# Altium schematic sheet Sheet3.SchDoc
size A3; SheetNumber: 1; SheetTotal: 2
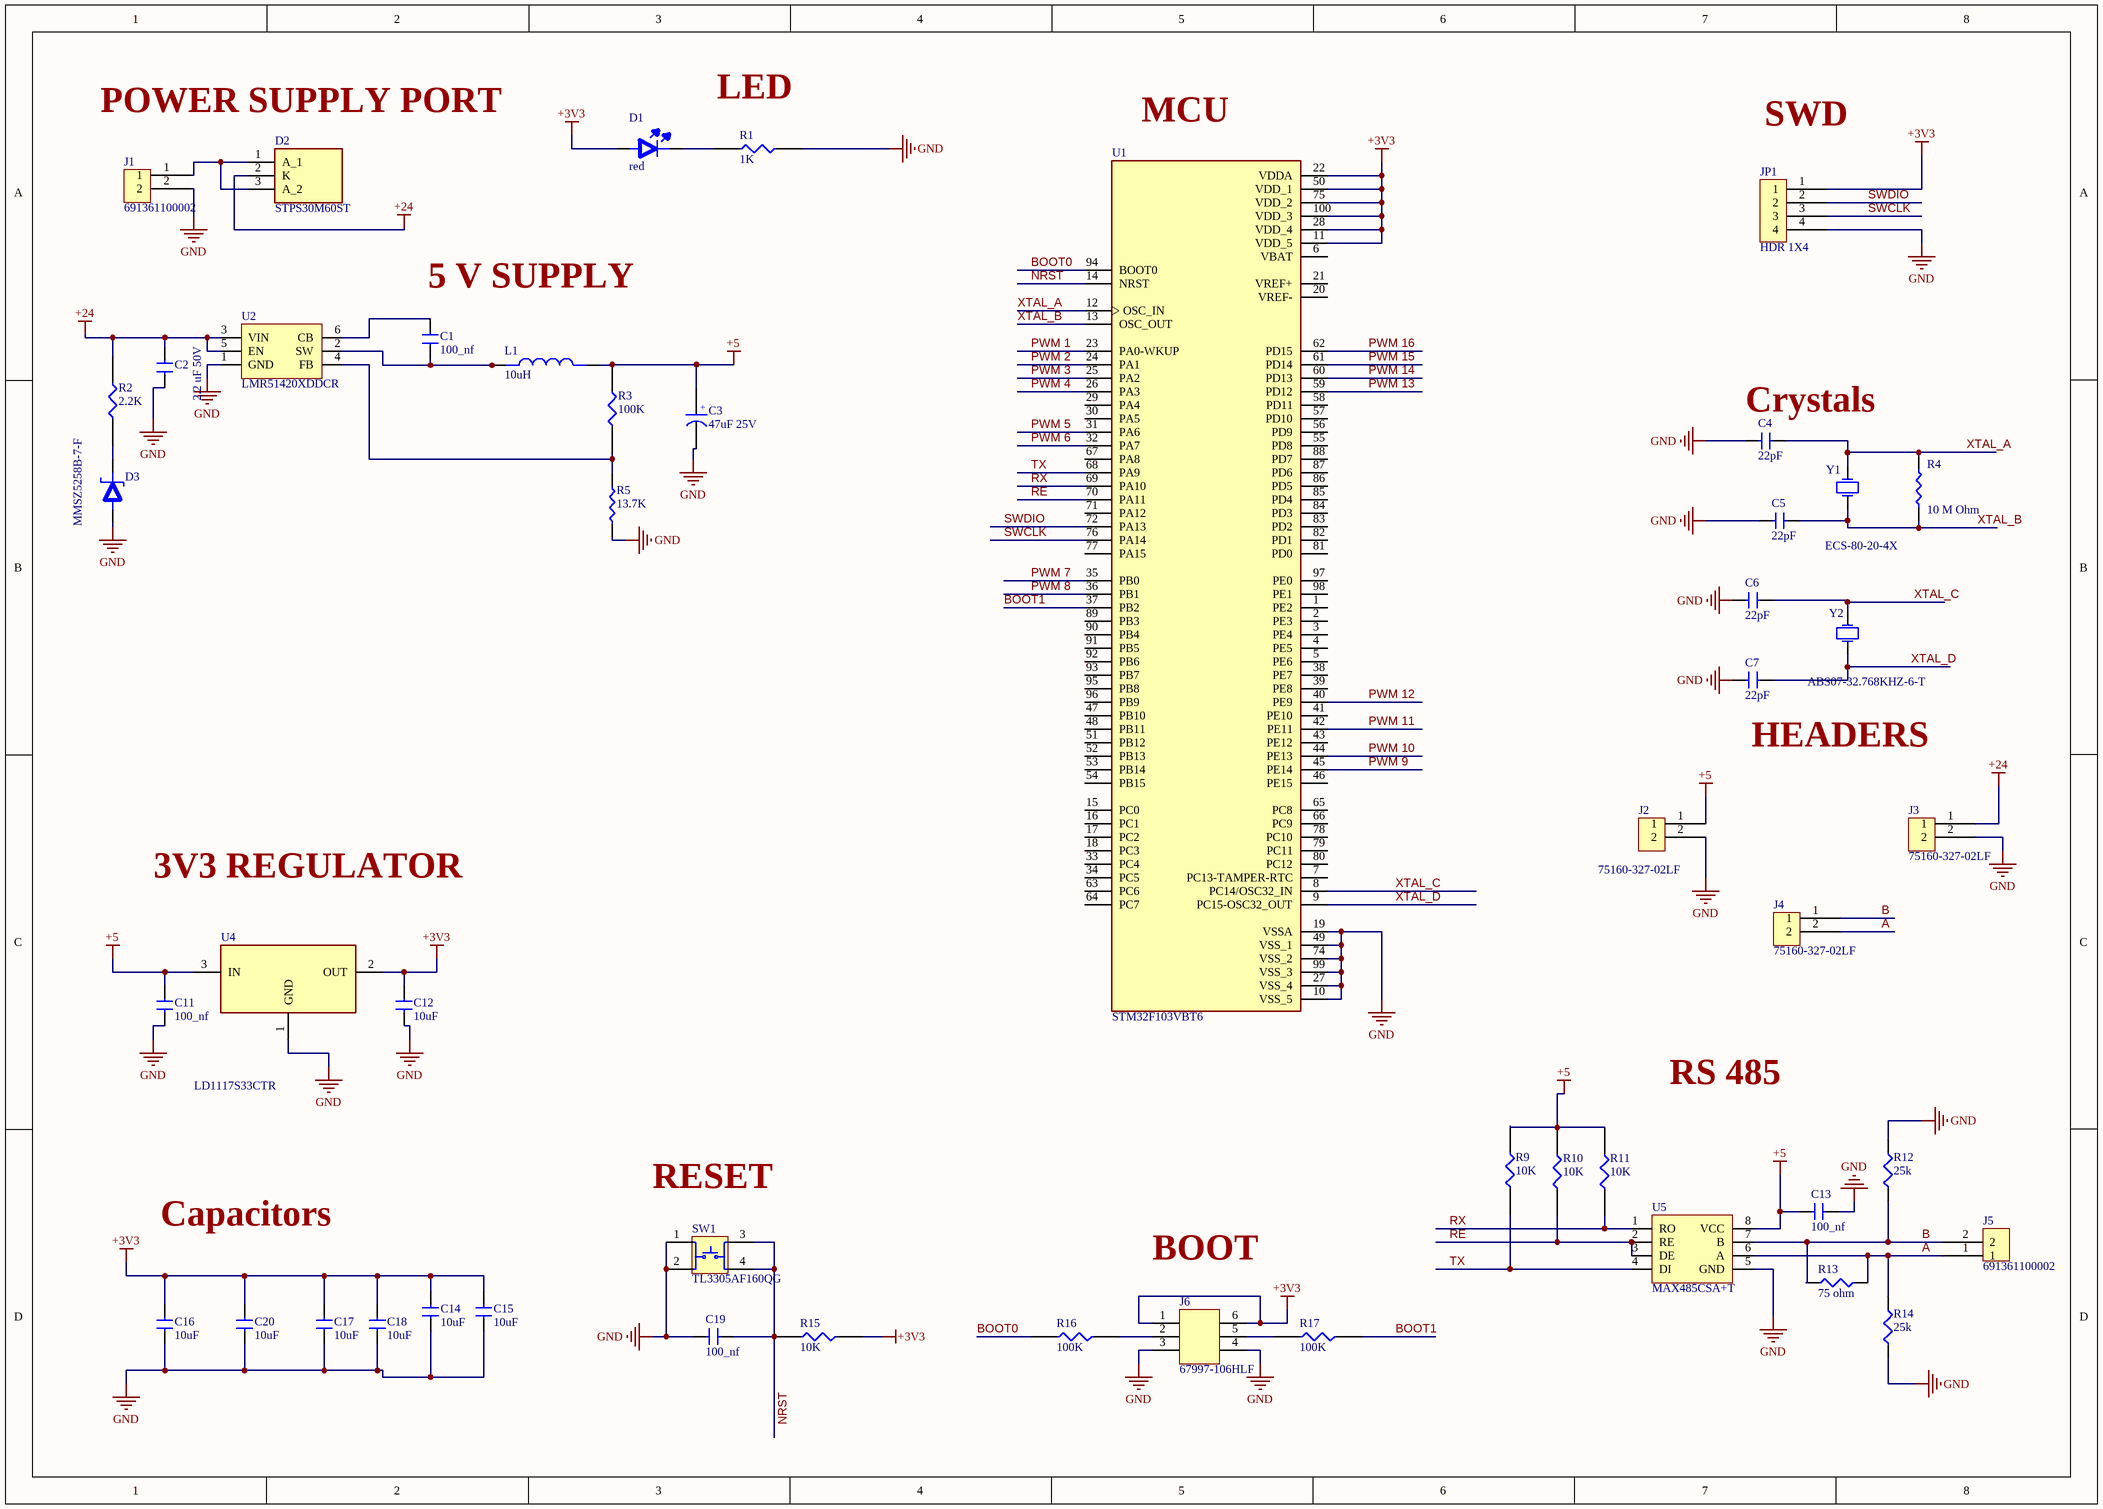
[diagram p0: Sheet3.SchDoc]

## Parts
C1  100_nf  [CAP_0805]
C2  2.2 uF 50V  [CAP_0805]
C3  47uF 25V  [CAP_ALU_D_Size]
C4  22pF  [CAP_0805]
C5  22pF  [CAP_0805]
C6  22pF  [CAP_0805]
C7  22pF  [CAP_0805]
C11  100_nf  [CAP_0805]
C12  10uF  [CAP_0805]
C13  100_nf  [CAP_0805]
C14  10uF  [CAP_0805]
C15  10uF  [CAP_0805]
C16  10uF  [CAP_0805]
C17  10uF  [CAP_0805]
C18  10uF  [CAP_0805]
C19  100_nf  [CAP_0805]
C20  10uF  [CAP_0805]
D1  red  [LED_RED_0805]
D2  STPS30M60ST  [TO255P460X1020X2008-3P]
D3  MMSZ5258B-7-F  [SOD-123]
J1  691361100002  [Screw Terminal 3.5mm]
J2  75160-327-02LF  [HDR 1x2]
J3  75160-327-02LF  [HDR 1x2]
J4  75160-327-02LF  [HDR 1x2]
J5  691361100002  [Screw Terminal 3.5mm]
J6  67997-106HLF  [MALE_HDR_3X2_2.54mm]
JP1  HDR 1X4  [HDR 1X4]
L1  10uH  [B952AS-H-100M=P3]
R1  1K  [R_0805]
R2  2.2K  [R_0805]
R3  100K  [R_0805]
R4  10 M Ohm  [R_0805]
R5  13.7K  [R_0805]
R9  10K  [R_0805]
R10  10K  [R_0805]
R11  10K  [R_0805]
R12  25k  [R_0805]
R13  75 ohm  [R_0805]
R14  25k  [R_0805]
R15  10K  [R_0805]
R16  100K  [R_0805]
R17  100K  [R_0805]
SW1  TL3305AF160QG  [SW_PB_SMD]
U1  STM32F103VBT6  [STM32F103VBT6]
U2  LMR51420XDDCR  [SOT 23-6]
U4  LD1117S33CTR  [SOT 223 3]
U5  MAX485CSA+T  [8 SOIC]
Y1  ECS-80-20-4X  [XTAL_8_MHZ]
Y2  ABS07-32.768KHZ-6-T  [XTAL_32.768 KHZ_SMD]

## Nets
+3V3: C12.2 C14.1 C15.1 C16.1 C17.1 C18.1 C20.1 D1.2(Anode) J6.1 J6.6 JP1.1 R15.2 U1.11(VDD_5) U1.22(VDDA) U1.28(VDD_4) U1.50(VDD_1) U1.75(VDD_2) U1.100(VDD_3) U4.2(OUT)
+5: C3.1 C11.1 C13.1 J2.1 L1.2 R3.2 R9.1 R10.1 R11.1 U4.3(IN) U5.8(VCC)
+24: C2.1 D2.2(K) J3.1 R2.2 U2.3(VIN) U2.5(EN)
GND: C2.2 C3.2 C4.1 C5.1 C6.1 C7.1 C11.2 C12.1 C13.2 C14.2 C15.2 C16.2 C17.2 C18.2 C19.1 C20.2 D3.2(Anode) J1.2 J2.2 J3.2 J6.3 J6.4 JP1.4 R1.2 R5.2 R12.2 R14.1 SW1.1 SW1.2 U1.10(VSS_5) U1.19(VSSA) U1.27(VSS_4) U1.49(VSS_1) U1.74(VSS_2) U1.99(VSS_3) U2.1(GND) U4.1(GND) U5.5(GND)
A: J4.2 J5.1 R13.2 R14.2 U5.6(A)
B: J4.1 J5.2 R12.1 R13.1 U5.7(B)
BOOT0: R16.1 U1.94(BOOT0)
BOOT1: R17.2 U1.37(PB2)
NRST: C19.2 R15.1 SW1.3 SW1.4 U1.14(NRST)
PWM 1: U1.23(PA0-WKUP)
PWM 2: U1.24(PA1)
PWM 3: U1.25(PA2)
PWM 4: U1.26(PA3)
PWM 5: U1.31(PA6)
PWM 6: U1.32(PA7)
PWM 7: U1.35(PB0)
PWM 8: U1.36(PB1)
PWM 9: U1.45(PE14)
PWM 10: U1.44(PE13)
PWM 11: U1.42(PE11)
PWM 12: U1.40(PE9)
PWM 13: U1.59(PD12)
PWM 14: U1.60(PD13)
PWM 15: U1.61(PD14)
PWM 16: U1.62(PD15)
RE: R10.2 U1.70(PA11) U5.2(RE) U5.3(DE)
RX: R11.2 U1.69(PA10) U5.1(RO)
SWCLK: JP1.3 U1.76(PA14)
SWDIO: JP1.2 U1.72(PA13)
TX: R9.2 U1.68(PA9) U5.4(DI)
XTAL_A: C4.2 R4.1 U1.12(OSC_IN) Y1.1
XTAL_B: C5.2 R4.2 U1.13(OSC_OUT) Y1.2
XTAL_C: C6.2 U1.8(PC14/OSC32_IN) Y2.1
XTAL_D: C7.2 U1.9(PC15-OSC32_OUT) Y2.2
NetC1_1: C1.1 U2.6(CB)
NetC1_2: C1.2 L1.1 U2.2(SW)
NetD1_1: D1.1(Cathode) R1.1
NetD2_1: D2.1(A_1) D2.3(A_2) J1.1
NetD3_1: D3.1(Cathode) R2.1
NetJ6_2: J6.2 R16.2
NetJ6_5: J6.5 R17.1
NetR3_1: R3.1 R5.1 U2.4(FB)

Not connected (* = marked no-connect by the designer): U1 1(PE2) 2(PE3) 3(PE4) 4(PE5) 5(PE6) 6(VBAT) 7(PC13-TAMPER-RTC) 15(PC0) 16(PC1) 17(PC2) 18(PC3) 20(VREF-) 21(VREF+) 29(PA4) 30(PA5) 33(PC4) 34(PC5) 38(PE7) 39(PE8) 41(PE10) 43(PE12) 46(PE15) 47(PB10) 48(PB11) 51(PB12) 52(PB13) 53(PB14) 54(PB15) 55(PD8) 56(PD9) 57(PD10) 58(PD11) 63(PC6) 64(PC7) 65(PC8) 66(PC9) 67(PA8) 71(PA12) 77(PA15) 78(PC10) 79(PC11) 80(PC12) 81(PD0) 82(PD1) 83(PD2) 84(PD3) 85(PD4) 86(PD5) 87(PD6) 88(PD7) 89(PB3) 90(PB4) 91(PB5) 92(PB6) 93(PB7) 95(PB8) 96(PB9) 97(PE0) 98(PE1)

## Notes on the sheet
- (near R1) LED
- POWER SUPPLY PORT
- (near U1) MCU
- SWD
- (near C1) 5 V SUPPLY
- (near C4) Crystals
- (near C7) HEADERS
- 3V3 REGULATOR
- RS 485
- (near SW1) RESET
- Capacitors
- BOOT
- (in symbol CAP_POLAR_47uF_25V) +

## Library data of the parts
C1 C11 C13 C19 = CAP_ 0.1uf: Cap Ceramic 0.1uF 50V X7R 10% SMD 0805 125°C Blister Plastic T/R; Manufacturer: TDK; Manufacturer Part Number: C2012X7R1H104K125AE; Capacitance: 100nF; Supplier 1: Mouser; RoHS: Yes; Category: Ceramic Capacitors; Stock 1: 49203; Pricing 1: 1=0.25000, 10=0.11500, 50=0.11500, 100=0.09800, 1000=0.06100, 10000=0.05200 (USD); Mount: Surface Mount; Case/Package: 0805; Case Code (Metric): 2012; Case Code (Imperial): 0805; Weight: 0.000194oz; Min Operating Temperature: -55°C; Max Operating Temperature: 125°C; Package Quantity: 2000; Packaging: Tape and Reel; Tolerance: 10%; Voltage Rating: 50V; Dielectric: X7R; Termination: SMD/SMT; Voltage Rating (DC): 50V; Features: Soft Termination; Length: 0.079inch; Width: 0.049inch; Height: 1.25mm; Thickness: 0.057inch; RoHS Compliant: Yes; ComponentLink1URL: https://datasheet.ciiva.com/29534/mlcc-commercial-soft-en-29534235.pdf?src-supplier=Digi-Key; ComponentLink1Description: https://datasheet.ciiva.com/29534/mlcc-commercial-soft-en-29534235.pdf?src-supplier=Digi-Key; Supplier Part Number 1: 810-C2012X7R1H104KAE
C2 = cap 2.2 uf 50V 0808: Cap Ceramic 2.2uF 50V JB 10% SMD 0805 85°C Blister Plastic T/R; Manufacturer: TDK; Manufacturer Part Number: C2012JB1H225K125AB; Supplier 1: Mouser; RoHS: Yes; Category: Ceramic Capacitors; Stock 1: 3924; Pricing 1: 1=0.50000, 10=0.27300, 50=0.27300, 100=0.23200, 500=0.17200, 1000=0.14600, 2000=0.13700, 4000=0.12800, 10000=0.11500, 24000=0.11300 (USD); Mount: Surface Mount; Case/Package: 0805; Case Code (Metric): 2012; Case Code (Imperial): 0805; Dielectric Material: Ceramic; Min Operating Temperature: -25°C; Max Operating Temperature: 85°C; Package Quantity: 2000; Packaging: Tape and Reel; Capacitance: 2.2uF; Tolerance: 10%; Voltage Rating: 50V; Termination: SMD/SMT; Resistor Type: Ceramic; Voltage Rating (DC): 50V; Series: C; Length: 0.079inch; Width: 0.049inch; Height: 1.25mm; Thickness: 0.057inch; Lead Free: Lead Free; RoHS Compliant: Yes; ComponentLink1URL: https://datasheet.ciiva.com/14908/tdkmlcccaprange-14908382.pdf?src-supplier=Digi-Key; ComponentLink1Description: https://datasheet.ciiva.com/14908/tdkmlcccaprange-14908382.pdf?src-supplier=Digi-Key; ComponentLink2URL: https://datasheet.ciiva.com/14908/tdkmlcccaprange-14908383.pdf?src-supplier=Digi-Key; ComponentLink2Description: https://datasheet.ciiva.com/14908/tdkmlcccaprange-14908383.pdf?src-supplier=Digi-Key; Supplier Part Number 1: 810-C2012JB1H225K12B
C3 = CAP_POLAR_47uF_25V: 贴片铝电解电容 47uF ±20% 25V 1000hrs@85°C AEC_D6.3x5.4mm_SM; Manufacturer: Panasonic; Manufacturer Part Number: EEE-1EA470WP; Ripple Current: 70mA; Life (Hours): 1000Hour; Supplier 1: Digi-Key; RoHS: Yes; Category: Aluminum Electrolytic Capacitors; Stock 1: 17240; Pricing 1: 1=0.49000, 10=0.33900, 50=0.23760, 100=0.20360, 500=0.15272 (USD); Mount: Surface Mount,PCB; Case/Package: Radial; Contact Plating: Tin; Min Operating Temperature: -40°C; Max Operating Temperature: 85°C; Capacitance: 47uF; Tolerance: 20%; Packaging: Tape and Reel; Voltage Rating: 25V; Voltage Rating (DC): 25V; Package Quantity: 1; Termination: SMD/SMT; Ripple Current (AC): 70mA; Series: S; Construction: Cylindrical; Diameter: 6.3mm; Length: 5.5mm; Height: 5.4mm; Height - Seated (Max): 0.213inch; Radiation Hardening: No; RoHS Compliant: Yes; REACH SVHC: Unknown; Lead Free: Lead Free; ComponentLink1URL: https://datasheet.ciiva.com/34302/1356009-34302242.pdf?src-supplier=Jameco; ComponentLink1Description: https://datasheet.ciiva.com/34302/1356009-34302242.pdf?src-supplier=Jameco; ComponentLink2URL: https://datasheet.ciiva.com/24068/aba0000ce2-40801-24068439.pdf?src-supplier=Mouser; ComponentLink2Description: https://datasheet.ciiva.com/24068/aba0000ce2-40801-24068439.pdf?src-supplier=Mouser; ComponentLink3URL: https://datasheet.ciiva.com/14599/70255710-14599015.pdf?src-supplier=Allied+Electronics; ComponentLink3Description: https://datasheet.ciiva.com/14599/70255710-14599015.pdf?src-supplier=Allied+Electronics; ComponentLink4URL: https://datasheet.ciiva.com/2985/aba0000ce2-2985137.pdf?src-supplier=Avnet; ComponentLink4Description: https://datasheet.ciiva.com/2985/aba0000ce2-2985137.pdf?src-supplier=Avnet; ComponentLink5URL: https://datasheet.ciiva.com/16201/aba0000ce2-16201990.pdf?src-supplier=Future+Electronics; ComponentLink5Description: https://datasheet.ciiva.com/16201/aba0000ce2-16201990.pdf?src-supplier=Future+Electronics; ComponentLink6URL: https://datasheet.ciiva.com/30153/11aba0000ce2-30153223.pdf?src-supplier=Onlinecomponents.com; ComponentLink6Description: https://datasheet.ciiva.com/30153/11aba0000ce2-30153223.pdf?src-supplier=Onlinecomponents.com; ComponentLink7URL: https://datasheet.ciiva.com/15166/getdatasheetpartid-135372-15166029.pdf?src-supplier=Verical; ComponentLink7Description: https://datasheet.ciiva.com/15166/getdatasheetpartid-135372-15166029.pdf?src-supplier=Verical; Supplier Part Number 1: PCE3908CT-ND
C4-C7 = CAP_22pF: Cap Ceramic 22pF 50V C0G 0.25pF SMD 0805 125°C Paper T/R; Manufacturer: KEMET; Manufacturer Part Number: C0805C220C5GACTU; Dissipation Factor: 0.1%; Supplier 1: Mouser; RoHS: Yes; Category: Ceramic Capacitors; Stock 1: 504; Pricing 1: 1=0.91000, 10=0.56400, 50=0.56400, 100=0.46200, 1000=0.32200, 10000=0.28100 (USD); Mount: Surface Mount; Case/Package: 0805; Dielectric Material: Ceramic; Case Code (Metric): 2012; Case Code (Imperial): 0805; Min Operating Temperature: -55°C; Max Operating Temperature: 125°C; Capacitance: 22pF; Voltage Rating (DC): 50V; Package Quantity: 4000; Voltage Rating: 50V; Packaging: Tape and Reel; Dielectric: C0G; Termination: SMD/SMT; Series: C0805C; Length: 0.079inch; Width: 0.049inch; Height: 0.78mm; Thickness: 0.035inch; Lead Pitch: 0.75mm; Lead Free: Lead Free; RoHS Compliant: Yes; ComponentLink1URL: https://datasheet.ciiva.com/5420/kem-c1003-c0g-smd-356956-5420078.pdf?src-supplier=Mouser; ComponentLink1Description: https://datasheet.ciiva.com/5420/kem-c1003-c0g-smd-356956-5420078.pdf?src-supplier=Mouser; Supplier Part Number 1: 80-C0805C220C5G
C12 C14-C18 C20 = CAP_10uF_0805: CERAMIC CAPACITOR, 10UF, 16V, X5R, 20%, 0805, FULL REEL; Product Range:C Series; Capacitance:10 F; Capacitance Tolerance: 20%; Dielectric Characteristic:X5R; Voltage Rating:16V; Ceramic Capacitor Case:0805 [2012 Metric]; MSL:- ;RoHS Compliant: Yes; Manufacturer: TDK; Manufacturer Part Number: C2012X5R1C106M125AC; Supplier 1: Digi-Key; RoHS: Yes; Category: Ceramic Capacitors; Mount: Surface Mount; Case/Package: 0805; Number of Pins: 2; Case Code (Metric): 2012; Case Code (Imperial): 0805; Dielectric Material: Ceramic; Weight: 0.000194oz; Min Operating Temperature: -55°C; Max Operating Temperature: 85°C; Capacitance: 10uF; Tolerance: 20%; Voltage Rating: 16V; Packaging: Tape and Reel; Voltage Rating (DC): 16V; Dielectric: X5R; Termination: SMD/SMT; Package Quantity: 1; Resistor Type: Ceramic; Series: C; Length: 0.079inch; Width: 0.049inch; Height: 1.25mm; Depth: 1.25mm; Thickness: 0.057inch; RoHS Compliant: Yes; REACH SVHC: No SVHC; Lead Free: Lead Free; ComponentLink1URL: https://datasheet.ciiva.com/6289/tdkmlcccaprange-6289238.pdf?src-supplier=Digi-Key; ComponentLink1Description: https://datasheet.ciiva.com/6289/tdkmlcccaprange-6289238.pdf?src-supplier=Digi-Key; ComponentLink2URL: https://datasheet.ciiva.com/22725/1913358-22725558.pdf?src-supplier=Element14; ComponentLink2Description: https://datasheet.ciiva.com/22725/1913358-22725558.pdf?src-supplier=Element14; ComponentLink3URL: https://datasheet.ciiva.com/6252/tdkmlcccaprange-6252105.pdf?src-supplier=Digi-Key; ComponentLink3Description: https://datasheet.ciiva.com/6252/tdkmlcccaprange-6252105.pdf?src-supplier=Digi-Key; ComponentLink4URL: https://datasheet.ciiva.com/6252/tdkmlcccaprange-6252108.pdf?src-supplier=Digi-Key; ComponentLink4Description: https://datasheet.ciiva.com/6252/tdkmlcccaprange-6252108.pdf?src-supplier=Digi-Key; ComponentLink5URL: https://datasheet.ciiva.com/23803/1796654-23803022.pdf?src-supplier=Newark; ComponentLink5Description: https://datasheet.ciiva.com/23803/1796654-23803022.pdf?src-supplier=Newark; Supplier Part Number 1: 445-4115-1-ND
D1 = LED_RED: Led SMT Red 0805 Tape; Manufacturer: Osram Opto; Manufacturer Part Number: LSR976-NR-1; Lens Color: White; Forward Current: 25mA; Forward Voltage: 2.5V; Luminous Intensity: 180mcd; Viewing Angle: 160°; Lens Style: Flat,Diffused,Colorless,Rectangular; Test Current: 20mA; Dominant Wavelength: 633nm; Luminous Flux: 0.47lm; Number of Elements: 1; Reverse Voltage: 12V; Power Dissipation: 65mW; Lens Transparency: Diffused; Lens Size: 1.25mm; Supplier 1: Avnet; RoHS: Yes; Category: LEDs; Stock 1: 360000; Pricing 1: 4000=0.03250, 8000=0.03167, 16000=0.03084, 24000=0.03002, 32000=0.02919, 40000=0.02836, 400000=0.02753 (USD); Mount: Surface Mount; Case/Package: 0805; Number of Pins: 2; Color: Red; Case Code (Metric): 2012; Case Code (Imperial): 0805; Min Operating Temperature: -30°C; Max Operating Temperature: 85°C; Packaging: Tape and Reel; Number of LEDs: 1; Illumination Color: Red; Package Quantity: 16000; Series: CHIPLED 0805; Length: 2.1mm; Width: 1.25mm; Height: 0.9mm; Depth: 1.35mm; Radiation Hardening: No; RoHS Compliant: Yes; ComponentLink1URL: https://datasheet.ciiva.com/4688/o-ls-ly-r976-24152-4688435.pdf?src-supplier=Mouser; ComponentLink1Description: https://datasheet.ciiva.com/4688/o-ls-ly-r976-24152-4688435.pdf?src-supplier=Mouser; ComponentLink2URL: https://datasheet.ciiva.com/26920/getdatasheetpartid-568367-26920831.pdf?src-supplier=Verical; ComponentLink2Description: https://datasheet.ciiva.com/26920/getdatasheetpartid-568367-26920831.pdf?src-supplier=Verical; ComponentLink3URL: https://datasheet.ciiva.com/2112/00078896-0-2112782.pdf?src-supplier=Digi-Key; ComponentLink3Description: https://datasheet.ciiva.com/2112/00078896-0-2112782.pdf?src-supplier=Digi-Key; ComponentLink4URL: https://datasheet.ciiva.com/2112/00078896-0-2112781.pdf?src-supplier=Digi-Key; ComponentLink4Description: https://datasheet.ciiva.com/2112/00078896-0-2112781.pdf?src-supplier=Digi-Key; ComponentLink5URL: https://datasheet.ciiva.com/2112/00078896-0-2112783.pdf?src-supplier=Digi-Key; ComponentLink5Description: https://datasheet.ciiva.com/2112/00078896-0-2112783.pdf?src-supplier=Digi-Key; Supplier Part Number 1: Q62702P5178
D2 = STPS30M60ST: Diode; Manufacturer: STMicroelectronics; Datasheet Link: https://altium.componentsearchengine.com/Datasheets/2/STPS30M60ST.pdf; Height: 4.6mm; Manufacturer Part Number: STPS30M60ST; Mouser Part Number: 511-STPS30M60ST; Mouser Price/Stock: https://www.mouser.co.uk/ProductDetail/STMicroelectronics/STPS30M60ST?qs=G49gCGQm93g6yOTYlfi6VA%3D%3D; Arrow Part Number: STPS30M60ST; Arrow Price/Stock: https://www.arrow.com/en/products/stps30m60st/stmicroelectronics
D3 = Zener 36V: Diode Zener Single 36V 5% 500mW Automotive 2-Pin SOD-123 T/R; Manufacturer: Diodes; Max Reverse Leakage Current: 100nA; Forward Voltage: 900mV; Impedance: 70R; Test Current: 3.4mA; Supplier 1: Arrow Electronics; Manufacturer Part Number: MMSZ5258B-7-F; RoHS: Yes; Category: Zener Diodes; Stock 1: 87000; Pricing 1: 3000=0.02940, 6000=0.02910, 9000=0.02880, 15000=0.02790, 24000=0.02700, 30000=0.02550, 45000=0.02430, 75000=0.02290 (USD); Mount: Surface Mount; Case/Package: SOD-123-2; Number of Pins: 2; Weight: 0.000353oz; Min Operating Temperature: -65°C; Max Operating Temperature: 150°C; Max Power Dissipation: 500mW; Zener Voltage: 36V; Element Configuration: Single; Package Quantity: 3000; Packaging: Tape and Reel; Tolerance: 5%; Voltage Tolerance: 5%; Power Dissipation: 500mW; Zener Current: 100nA; Working Voltage: 36V; Max Reverse Current: 100nA; Termination: SMD/SMT; Power Rating: 500mW; Voltage Rating (DC): 36V; Voltage: 36V; Series: -; Length: 3.85mm; Width: 1.7mm; Height: 1.35mm; Radiation Hardening: No; Lead Free: Lead Free; RoHS Compliant: Yes; ComponentLink1URL: http://components.arrow.com/part/dataview/41509547S9715019N2867?src-supplier=Arrow+Electronics; ComponentLink1Description: http://components.arrow.com/part/dataview/41509547S9715019N2867?src-supplier=Arrow+Electronics; ComponentLink2URL: http://uk.rs-online.com/webdocs/1321/0900766b81321cf1.pdf?src-supplier=RSComponents; ComponentLink2Description: http://uk.rs-online.com/webdocs/1321/0900766b81321cf1.pdf?src-supplier=RSComponents; ComponentLink3URL: http://www.mouser.com/ds/2/115/ds18010-38133.pdf?src-supplier=Mouser; ComponentLink3Description: http://www.mouser.com/ds/2/115/ds18010-38133.pdf?src-supplier=Mouser; ComponentLink4URL: http://www.alliedelec.com/m/d/de319de85f518c8fbc32dc1eb490a736.pdf?src-supplier=Allied+Electronics; ComponentLink4Description: http://www.alliedelec.com/m/d/de319de85f518c8fbc32dc1eb490a736.pdf?src-supplier=Allied+Electronics; ComponentLink5URL: http://www.onlinecomponents.com/datasheet/mmsz5258b-7-f.aspx?p=11234656&src-supplier=Onlinecomponents.com; ComponentLink5Description: http://www.onlinecomponents.com/datasheet/mmsz5258b-7-f.aspx?p=11234656&src-supplier=Onlinecomponents.com; ComponentLink6URL: https://www.diodes.com/assets/Datasheets/ds18010.pdf?src-supplier=Digi-Key; ComponentLink6Description: https://www.diodes.com/assets/Datasheets/ds18010.pdf?src-supplier=Digi-Key; ComponentLink7URL: http://www.diodes.com/datasheets/ds18010.pdf?src-supplier=Avnet; ComponentLink7Description: http://www.diodes.com/datasheets/ds18010.pdf?src-supplier=Avnet; ComponentLink8URL: http://www.diodes.com/datasheets/ds18010.pdf?src-supplier=Future+Electronics; ComponentLink8Description: http://www.diodes.com/datasheets/ds18010.pdf?src-supplier=Future+Electronics; Supplier Part Number 1: MMSZ5258B-7-F
J1 J5 = Screw Tarminal 3.5mm pitch: 3611 Series 3.5mm Pitch Straight Pluggable Term Block; Plug; Cable Mount; 2 Way; Manufacturer: Wurth Electronics; Current Rating: 10A; Voltage Rating: 300V; Number of Positions Per Level: 2; Number of Levels: 1; Wire/Cable Gauge: 26AWG; Wire Gauge (Min): 16AWG; Pitch: 0.138inch; Stripping Length: -7mm; Supplier 1: RSComponents; Manufacturer Part Number: 691361100002; RoHS: Yes; Category: Terminal Blocks; Stock 1: 1; Pricing 1: 1=2.51400, 10=2.28700, 50=2.12400, 100=2.02300, 250=1.93500 (USD); Mount: Free Hanging; Color: Green; Contact Material: Brass; Package Quantity: 650; Packaging: Bulk; Termination: Screw; Current: 10A; Voltage: 300V; Number of Contacts: 2; Series: WR-TBL Series 3611; Length: 15.8mm; Width: 3.5mm; Height: 11.1mm; Wire Gauge (Max): 26AWG; REACH SVHC: Unknown; RoHS Compliant: Yes; Lead Free: Lead Free; ComponentLink1URL: https://datasheet.ciiva.com/7992/1442235-7992395.pdf?src-supplier=Element14; ComponentLink1Description: https://datasheet.ciiva.com/7992/1442235-7992395.pdf?src-supplier=Element14; ComponentLink2URL: https://datasheet.ciiva.com/796/6913611000xx-796028.pdf?src-supplier=Digi-Key; ComponentLink2Description: https://datasheet.ciiva.com/796/6913611000xx-796028.pdf?src-supplier=Digi-Key; Supplier Part Number 1: 8250806
J2-J4 = MALE_HDR_1X2: Conn Unshrouded Header HDR 2 POS 2.54mm Solder ST Thru-Hole Poly Bag; Manufacturer: Amphenol ICC / FCI; Supplier 1: Avnet; Manufacturer Part Number: 75160-327-02LF; RoHS: Yes; Category: Connectors; Pricing 1: 100=0.09225, 200=0.08985, 400=0.08745, 600=0.08506, 800=0.08266, 1000=0.08027, 10000=0.07787 (USD); ComponentLink1URL: https://datasheet.ciiva.com/10145/75160-10145737.pdf?src-supplier=Avnet; ComponentLink1Description: https://datasheet.ciiva.com/10145/75160-10145737.pdf?src-supplier=Avnet; ComponentLink2URL: https://datasheet.ciiva.com/13670/75160-99052-13670687.pdf?src-supplier=Mouser; ComponentLink2Description: https://datasheet.ciiva.com/13670/75160-99052-13670687.pdf?src-supplier=Mouser; Supplier Part Number 1: 75160-327-02LF
J6 = Male_HDR_3X2_2.54mm_Pitch: Conn Unshrouded Header HDR 6 POS 2.54mm Solder ST Top Entry Thru-Hole BergStik® Bulk; Manufacturer: Amphenol ICC / FCI; Supplier 1: Avnet; Manufacturer Part Number: 67997-106HLF; RoHS: No; Category: Headers and Wire Housings; Stock 1: 9; Pricing 1: 1=1.53000 (USD); ComponentLink1URL: http://uk.rs-online.com/webdocs/1450/0900766b81450b8b.pdf?src-supplier=RSComponents; ComponentLink1Description: http://uk.rs-online.com/webdocs/1450/0900766b81450b8b.pdf?src-supplier=RSComponents; ComponentLink2URL: https://cdn.amphenol-icc.com/media/wysiwyg/files/drawing/67996.pdf?src-supplier=Digi-Key; ComponentLink2Description: https://cdn.amphenol-icc.com/media/wysiwyg/files/drawing/67996.pdf?src-supplier=Digi-Key; ComponentLink3URL: http://components.arrow.com/part/dataview/41913658S7633350N8314?src-supplier=Arrow+Electronics; ComponentLink3Description: http://components.arrow.com/part/dataview/41913658S7633350N8314?src-supplier=Arrow+Electronics; ComponentLink4URL: http://www.farnell.com/datasheets/1876884.pdf?src-supplier=Newark; ComponentLink4Description: http://www.farnell.com/datasheets/1876884.pdf?src-supplier=Newark; ComponentLink5URL: https://cdn.amphenol-icc.com/media/wysiwyg/files/drawing/67996.pdf?src-supplier=Allied+Electronics; ComponentLink5Description: https://cdn.amphenol-icc.com/media/wysiwyg/files/drawing/67996.pdf?src-supplier=Allied+Electronics; ComponentLink6URL: https://cdn.amphenol-icc.com/media/wysiwyg/files/drawing/67996.pdf?src-supplier=Mouser; ComponentLink6Description: https://cdn.amphenol-icc.com/media/wysiwyg/files/drawing/67996.pdf?src-supplier=Mouser; ComponentLink7URL: http://www.farnell.com/datasheets/1876884.pdf?src-supplier=Farnell; ComponentLink7Description: http://www.farnell.com/datasheets/1876884.pdf?src-supplier=Farnell; ComponentLink8URL: https://cdn.amphenol-icc.com/media/wysiwyg/files/drawing/67996.pdf?src-supplier=Avnet; ComponentLink8Description: https://cdn.amphenol-icc.com/media/wysiwyg/files/drawing/67996.pdf?src-supplier=Avnet; ComponentLink9URL: https://cdn.amphenol-icc.com/media/wysiwyg/files/drawing/67996.pdf?src-supplier=Onlinecomponents.com; ComponentLink9Description: https://cdn.amphenol-icc.com/media/wysiwyg/files/drawing/67996.pdf?src-supplier=Onlinecomponents.com; ComponentLink10URL: https://cdn.amphenol-icc.com/media/wysiwyg/files/drawing/67996.pdf?src-supplier=TTI; ComponentLink10Description: https://cdn.amphenol-icc.com/media/wysiwyg/files/drawing/67996.pdf?src-supplier=TTI; ComponentLink11URL: https://cdn.amphenol-icc.com/media/wysiwyg/files/drawing/67996.pdf?src-supplier=Heilind+Electronics; ComponentLink11Description: https://cdn.amphenol-icc.com/media/wysiwyg/files/drawing/67996.pdf?src-supplier=Heilind+Electronics; Supplier Part Number 1: 06M1758
JP1 = MALE_HDR_4X1_Unschrouded: Conn Unshrouded Header HDR 4 POS 2.54mm Solder ST Thru-Hole Bag; Manufacturer: Amphenol ICC; Manufacturer Part Number: 68001-204HLF; Supplier 1: Allied Electronics; RoHS: Yes; Category: Headers and Wire Housings; ComponentLink1URL: http://www.farnell.com/cad/2615197.pdf?src-supplier=Farnell; ComponentLink1Description: http://www.farnell.com/cad/2615197.pdf?src-supplier=Farnell; ComponentLink2URL: http://www.farnell.com/cad/2615197.pdf?src-supplier=Newark; ComponentLink2Description: http://www.farnell.com/cad/2615197.pdf?src-supplier=Newark; Supplier Part Number 1: 70302499
L1 = Inductor 10uH A: Inductor Power Shielded Wirewound 10uH 20% 100KHz Ferrite 2.7A 0.044Ohm DCR 4040 T/R; Manufacturer: Murata; Manufacturer Part Number: #B952AS-H-100M=P3; Saturation Current: 3.6A; DC Resistance (DCR): 44mR; Supplier 1: Mouser; RoHS: Yes; Category: Fixed Inductors; Stock 1: 8; Pricing 1: 1=1.14000, 10=0.83800, 50=0.83800, 100=0.70400, 1000=0.51400, 10000=0.46800 (USD); Mount: Surface Mount; Case/Package: Nonstandard; Core Material: Ferrite; Min Operating Temperature: -40°C; Max Operating Temperature: 85°C; Packaging: Tape and Reel; Resistor Type: Wirewound; Inductance: 10uH; Current Rating: 2.7A; Shielding: Shielded; Test Frequency: 100kHz; Tolerance: 20%; Length: 0.409inch; Width: 0.409inch; Height - Seated (Max): 0.19inch; RoHS Compliant: Yes; ComponentLink1URL: http://www.murata.com/~/media/webrenewal/products/inductor/chip/tokoproducts/wirewoundferritetypeforpl/m_ds104c2.ashx?src-supplier=Digi-Key; ComponentLink1Description: http://www.murata.com/~/media/webrenewal/products/inductor/chip/tokoproducts/wirewoundferritetypeforpl/m_ds104c2.ashx?src-supplier=Digi-Key; Supplier Part Number 1: 81-B952AS-H-100MP3
R1 = RES_1_K_0805: 贴片电阻 1000Ω ± 1.00% 0.125W ± 100ppm/℃ 0805; Manufacturer: Yageo; Manufacturer Part Number: RC0805FR-071KL; Tolerance: 1%; Resistance: 1kR; Temperature Coefficient: 100ppm/°C; Voltage Rating (DC): 150V; Power Rating: 125mW; Supplier 1: Future Electronics; RoHS: Yes; Category: Chip SMD Resistors; Stock 1: 10195000; Pricing 1: 5000=0.00390 (USD); Case/Package: 0805; Number of Pins: 2; Case Code (Metric): 2012; Case Code (Imperial): 0805; Size Code: 0805; Min Operating Temperature: -55°C; Max Operating Temperature: 155°C; Packaging: Tape and Reel; Resistor Type: Thick Film; Package Quantity: 1; Voltage Rating: 150V; Number of Terminations: 2; Termination: SMD/SMT; Max Power Dissipation: 125mW; Features: Moisture Resistant; Series: RC; Resistance Tolerance: 1%; Construction: Rectangular; Length: 0.079inch; Width: 0.049inch; Height: 0.024inch; Depth: 1.25mm; REACH SVHC: Unknown; Lead Free: Lead Free; RoHS Compliant: Yes; Military Standard: Not; ComponentLink1URL: https://datasheet.ciiva.com/7941/1686128-7941719.pdf?src-supplier=Element14; ComponentLink1Description: https://datasheet.ciiva.com/7941/1686128-7941719.pdf?src-supplier=Element14; ComponentLink2URL: https://datasheet.ciiva.com/46385/444164-46385020.pdf?src-supplier=Element14; ComponentLink2Description: https://datasheet.ciiva.com/46385/444164-46385020.pdf?src-supplier=Element14; ComponentLink3URL: https://datasheet.ciiva.com/2456/pyu-r-int-thick-7-2456976.pdf?src-supplier=Digi-Key; ComponentLink3Description: https://datasheet.ciiva.com/2456/pyu-r-int-thick-7-2456976.pdf?src-supplier=Digi-Key; ComponentLink4URL: https://datasheet.ciiva.com/2456/pyu-r-int-thick-7-2456977.pdf?src-supplier=Digi-Key; ComponentLink4Description: https://datasheet.ciiva.com/2456/pyu-r-int-thick-7-2456977.pdf?src-supplier=Digi-Key; ComponentLink5URL: https://datasheet.ciiva.com/2456/pyu-r-int-thick-7-2456975.pdf?src-supplier=Digi-Key; ComponentLink5Description: https://datasheet.ciiva.com/2456/pyu-r-int-thick-7-2456975.pdf?src-supplier=Digi-Key; ComponentLink6URL: https://datasheet.ciiva.com/16850/rc0805-16850409.pdf?src-supplier=Future+Electronics; ComponentLink6Description: https://datasheet.ciiva.com/16850/rc0805-16850409.pdf?src-supplier=Future+Electronics; Supplier Part Number 1: 8126013
R2 = RES_2.2K 0805: Res High Precision Thin Film 0805 2.2k Ohm 0.1% 1/8W ±15ppm/°C Molded Paper T/R; Manufacturer: Yageo; Manufacturer Part Number: RT0805BRC072K2L; Resistance: 2.2kR; Max Power Dissipation: 125mW; Supplier 1: Digi-Key; RoHS: Yes; Category: Chip SMD Resistors; Stock 1: 3453; Pricing 1: 1=0.73000, 10=0.60700, 100=0.40790, 1000=0.23864, 2500=0.23083 (USD); Case/Package: 0805; Case Code (Metric): 2012; Case Code (Imperial): 0805; Min Operating Temperature: -55°C; Max Operating Temperature: 155°C; Tolerance: 0.1%; Packaging: Tape and Reel; Resistor Type: Thin Film; Number of Terminations: 2; Temperature Coefficient: 15ppm/°C; Features: Moisture Resistant; Length: 0.079inch; Width: 0.049inch; Height: 0.024inch; ComponentLink1URL: http://www.yageo.com/documents/recent/PYu-RT_1-to-0.01_RoHS_L_7.pdf?src-supplier=Digi-Key; ComponentLink1Description: http://www.yageo.com/documents/recent/PYu-RT_1-to-0.01_RoHS_L_7.pdf?src-supplier=Digi-Key; ComponentLink2URL: http://www.yageo.com/documents/recent/PYu-RT_1-to-0.01_RoHS_L_9.pdf?src-supplier=Digi-Key; ComponentLink2Description: http://www.yageo.com/documents/recent/PYu-RT_1-to-0.01_RoHS_L_9.pdf?src-supplier=Digi-Key; Supplier Part Number 1: YAG2188CT-ND
R3 R16 R17 = RES_100_K_0805: 贴片电阻 100000Ω ± 1.00% 0.125W ± 100ppm/℃ 0805; Manufacturer: Yageo; Manufacturer Part Number: RC0805FR-07100KL; Tolerance: 1%; Resistance: 100kR; Power Rating: 125mW; Voltage Rating (DC): 150V; Temperature Coefficient: 100ppm/°C; Supplier 1: Avnet; RoHS: Yes; Category: Chip SMD Resistors; Stock 1: 345000; Pricing 1: 5000=0.00227, 10000=0.00224, 20000=0.00217 (USD); Case/Package: 0805; Number of Pins: 2; Case Code (Metric): 2012; Case Code (Imperial): 0805; Size Code: 0805; Min Operating Temperature: -55°C; Max Operating Temperature: 155°C; Resistor Type: Thick Film; Packaging: Tape and Reel; Voltage Rating: 150V; Package Quantity: 1; Number of Terminations: 2; Termination: SMD/SMT; Max Power Dissipation: 125mW; Features: Moisture Resistant; Series: RC; Construction: Rectangular; Resistance Tolerance: 1%; Technology: THICK FILM; Length: 2mm; Width: 0.049inch; Height: 0.024inch; Depth: 1.25mm; Lead Pitch: 0.4mm; REACH SVHC: Unknown; Lead Free: Lead Free; RoHS Compliant: Yes; Military Standard: Not; ComponentLink1URL: https://datasheet.ciiva.com/11808/0900766b8106beab-11808858.pdf?src-supplier=RSComponents; ComponentLink1Description: https://datasheet.ciiva.com/11808/0900766b8106beab-11808858.pdf?src-supplier=RSComponents; ComponentLink2URL: https://datasheet.ciiva.com/7941/1686128-7941677.pdf?src-supplier=Element14; ComponentLink2Description: https://datasheet.ciiva.com/7941/1686128-7941677.pdf?src-supplier=Element14; ComponentLink3URL: https://datasheet.ciiva.com/7660/38627-7660796.pdf?src-supplier=Element14; ComponentLink3Description: https://datasheet.ciiva.com/7660/38627-7660796.pdf?src-supplier=Element14; ComponentLink4URL: https://datasheet.ciiva.com/22747/444164-22747534.pdf?src-supplier=Element14; ComponentLink4Description: https://datasheet.ciiva.com/22747/444164-22747534.pdf?src-supplier=Element14; ComponentLink5URL: https://datasheet.ciiva.com/2457/pyu-r-int-thick-7-2457018.pdf?src-supplier=Digi-Key; ComponentLink5Description: https://datasheet.ciiva.com/2457/pyu-r-int-thick-7-2457018.pdf?src-supplier=Digi-Key; ComponentLink6URL: https://datasheet.ciiva.com/2457/pyu-r-int-thick-7-2457019.pdf?src-supplier=Digi-Key; ComponentLink6Description: https://datasheet.ciiva.com/2457/pyu-r-int-thick-7-2457019.pdf?src-supplier=Digi-Key; ComponentLink7URL: https://datasheet.ciiva.com/2457/pyu-r-int-thick-7-2457017.pdf?src-supplier=Digi-Key; ComponentLink7Description: https://datasheet.ciiva.com/2457/pyu-r-int-thick-7-2457017.pdf?src-supplier=Digi-Key; ComponentLink8URL: https://datasheet.ciiva.com/12667/rc0805-12667001.pdf?src-supplier=Mouser; ComponentLink8Description: https://datasheet.ciiva.com/12667/rc0805-12667001.pdf?src-supplier=Mouser; ComponentLink9URL: https://datasheet.ciiva.com/7941/1697719-7941676.pdf?src-supplier=Element14; ComponentLink9Description: https://datasheet.ciiva.com/7941/1697719-7941676.pdf?src-supplier=Element14; ComponentLink10URL: https://datasheet.ciiva.com/7941/1697719-7941678.pdf?src-supplier=Element14; ComponentLink10Description: https://datasheet.ciiva.com/7941/1697719-7941678.pdf?src-supplier=Element14; ComponentLink11URL: https://datasheet.ciiva.com/16747/rc0805-16747226.pdf?src-supplier=Future+Electronics; ComponentLink11Description: https://datasheet.ciiva.com/16747/rc0805-16747226.pdf?src-supplier=Future+Electronics; Supplier Part Number 1: RC0805FR-07100KL
R4 = Res_10 M_Ohm: 贴片电阻 10000000Ω ± 1.00% 0.125W ± 100ppm/℃ 0805; Manufacturer: Yageo; Manufacturer Part Number: RC0805FR-0710ML; Voltage Rating: 150V; Power Rating: 125mW; Tolerance: 1%; Resistance: 10MR; Temperature Coefficient: 100ppm/°C; Supplier 1: Mouser; RoHS: Yes; Category: Chip SMD Resistors; Stock 1: 4; Pricing 1: 1=0.10000, 10=0.03900, 50=0.03900, 100=0.01600, 1000=0.00800, 2500=0.00700, 5000=0.00500, 10000=0.00400 (USD); Case/Package: 0805; Number of Pins: 2; Case Code (Imperial): 0805; Case Code (Metric): 2012; Min Operating Temperature: -55°C; Max Operating Temperature: 155°C; Packaging: Tape and Reel; Voltage Rating (DC): 150V; Termination: SMD/SMT; Resistor Type: Thick Film; Working Voltage: 150V; Number of Terminations: 2; Features: Moisture Resistant; Series: RC; Max Power Dissipation: 125mW; Resistance Tolerance: 1%; Technology: THICK FILM; Construction: Rectangular; Length: 2mm; Width: 1.25mm; Height: 0.5mm; Depth: 1.25mm; REACH SVHC: Unknown; Military Standard: Not; Lead Free: Lead Free; RoHS Compliant: Yes; ComponentLink1URL: https://datasheet.ciiva.com/11819/0900766b8106beab-11819794.pdf?src-supplier=RSComponents; ComponentLink1Description: https://datasheet.ciiva.com/11819/0900766b8106beab-11819794.pdf?src-supplier=RSComponents; ComponentLink2URL: https://datasheet.ciiva.com/46447/444164-46447564.pdf?src-supplier=Element14; ComponentLink2Description: https://datasheet.ciiva.com/46447/444164-46447564.pdf?src-supplier=Element14; ComponentLink3URL: https://datasheet.ciiva.com/12667/rc0805-12667934.pdf?src-supplier=Mouser; ComponentLink3Description: https://datasheet.ciiva.com/12667/rc0805-12667934.pdf?src-supplier=Mouser; ComponentLink4URL: https://datasheet.ciiva.com/7941/444164-7941686.pdf?src-supplier=Element14; ComponentLink4Description: https://datasheet.ciiva.com/7941/444164-7941686.pdf?src-supplier=Element14; ComponentLink5URL: https://datasheet.ciiva.com/7941/444164-7941685.pdf?src-supplier=Element14; ComponentLink5Description: https://datasheet.ciiva.com/7941/444164-7941685.pdf?src-supplier=Element14; ComponentLink6URL: https://datasheet.ciiva.com/16741/rc0805-16741023.pdf?src-supplier=Future+Electronics; ComponentLink6Description: https://datasheet.ciiva.com/16741/rc0805-16741023.pdf?src-supplier=Future+Electronics; Supplier Part Number 1: 603-RC0805FR-0710ML
R5 = RES 13.7K 0805: Res Thick Film 0805 13.7K Ohm 1% 1/8W ±100ppm/°C SMD Paper T/R; Manufacturer: Yageo; Manufacturer Part Number: RC0805FR-0713K7L; Resistance: 13.7kR; Power Rating: 125mW; Voltage Rating: 150V; Supplier 1: Arrow Electronics; RoHS: Yes; Category: Chip SMD Resistors; Stock 1: 160000; Pricing 1: 5000=0.00490, 10000=0.00370, 25000=0.00240, 125000=0.00230 (USD); Case/Package: 0805; Contact Plating: Tin,Matte,Lead; Case Code (Metric): 2012; Case Code (Imperial): 0805; Size Code: 0805; Min Operating Temperature: -55°C; Max Operating Temperature: 155°C; Tolerance: 1%; Resistor Type: Thick Film; Temperature Coefficient: 100ppm/°C; Package Quantity: 1; Packaging: Tape and Reel; Number of Terminations: 2; Termination: SMD/SMT; Max Power Dissipation: 125mW; Voltage Rating (DC): 150V; Features: Moisture Resistant; Series: RC; Construction: Rectangular; Length: 2mm; Width: 0.049inch; Height: 0.024inch; Depth: 1.25mm; Radiation Hardening: No; Military Standard: Not; Lead Free: Lead Free; RoHS Compliant: Yes; ComponentLink1URL: https://datasheet.ciiva.com/2457/pyu-r-int-thick-7-2457327.pdf?src-supplier=Digi-Key; ComponentLink1Description: https://datasheet.ciiva.com/2457/pyu-r-int-thick-7-2457327.pdf?src-supplier=Digi-Key; ComponentLink2URL: https://datasheet.ciiva.com/2457/pyu-r-int-thick-7-2457328.pdf?src-supplier=Digi-Key; ComponentLink2Description: https://datasheet.ciiva.com/2457/pyu-r-int-thick-7-2457328.pdf?src-supplier=Digi-Key; ComponentLink3URL: https://datasheet.ciiva.com/2457/pyu-r-int-thick-7-2457326.pdf?src-supplier=Digi-Key; ComponentLink3Description: https://datasheet.ciiva.com/2457/pyu-r-int-thick-7-2457326.pdf?src-supplier=Digi-Key; ComponentLink4URL: https://datasheet.ciiva.com/12560/rc0805-257173-12560489.pdf?src-supplier=Mouser; ComponentLink4Description: https://datasheet.ciiva.com/12560/rc0805-257173-12560489.pdf?src-supplier=Mouser; ComponentLink5URL: https://datasheet.ciiva.com/17423/rc0805-17423338.pdf?src-supplier=Future+Electronics; ComponentLink5Description: https://datasheet.ciiva.com/17423/rc0805-17423338.pdf?src-supplier=Future+Electronics; Supplier Part Number 1: RC0805FR-0713K7L
R9-R11 R15 = RES_10_K_0805: 贴片电阻 10000Ω ± 1.00% 0.125W ± 100ppm/℃ 0805; Manufacturer: Yageo; Manufacturer Part Number: RC0805FR-0710KL; Resistance: 10kR; Tolerance: 1%; Temperature Coefficient: 100ppm/°C; Power Rating: 125mW; Voltage Rating: 150V; Supplier 1: Avnet; RoHS: Yes; Category: Chip SMD Resistors; Stock 1: 725000; Pricing 1: 5000=0.00227, 10000=0.00224, 20000=0.00217 (USD); Case/Package: 0805; Case Code (Imperial): 0805; Case Code (Metric): 2012; Size Code: 0805; Min Operating Temperature: -55°C; Max Operating Temperature: 155°C; Packaging: Tape and Reel; Resistor Type: Thick Film; Package Quantity: 1; Termination: SMD/SMT; Number of Terminations: 2; Max Power Dissipation: 125mW; Features: Moisture Resistant; Series: RC; Construction: Rectangular; Resistance Tolerance: 1%; Technology: THICK FILM; Length: 2mm; Width: 0.049inch; Height: 0.024inch; Depth: 1.25mm; REACH SVHC: Unknown; Lead Free: Lead Free; Military Standard: Not; RoHS Compliant: Yes; Supplier Part Number 1: RC0805FR-0710KL
R12 R14 = RES 25K 0805: Res Thin Film 0805 25K Ohm 0.1% 1/10W ±25ppm/°C Molded SMD SMD Paper T/R; Manufacturer: TE Connectivity; Manufacturer Part Number: 1614911-6; Supplier 1: Arrow Electronics; RoHS: Yes; Category: Chip SMD Resistors; Stock 1: 3000; Pricing 1: 1000=0.12840, 2000=0.12380 (USD); ComponentLink1URL: https://datasheet.ciiva.com/3262/eng-ds-1773200-g-3262698.pdf?src-supplier=Avnet; ComponentLink1Description: https://datasheet.ciiva.com/3262/eng-ds-1773200-g-3262698.pdf?src-supplier=Avnet; Supplier Part Number 1: 1614911-6
R13 = Res 75 ohm 0805: Anti-Sulfurated Chip Resistor Automotive Grade Thick Film 0805 75Ohm 5% Paper T/R; Manufacturer: Yageo; Manufacturer Part Number: AA0805JR-0775RL; Resistance: 75R; Max Power Dissipation: 125mW; Temperature Coefficient: 150ppm/°C; Supplier 1: Avnet; RoHS: Yes; Category: Chip SMD Resistors; Pricing 1: 5000=0.00470, 10000=0.00464, 20000=0.00450 (USD); Case/Package: 0805; Min Operating Temperature: -55°C; Max Operating Temperature: 155°C; Packaging: Tape and Reel; Resistor Type: Thick Film; Number of Terminations: 2; Tolerance: 5%; Features: Moisture Resistant,Automotive AEC-Q200,Anti-Sulfur; Length: 0.079inch; Width: 0.049inch; Height: 0.024inch; RoHS Compliant: Yes; ComponentLink1URL: http://www.yageo.com/NewPortal/yageodocoutput?fileName=/pdf/R-Chip/PYu-AA_51_RoHS_L_3.pdf&src-supplier=Digi-Key; ComponentLink1Description: http://www.yageo.com/NewPortal/yageodocoutput?fileName=/pdf/R-Chip/PYu-AA_51_RoHS_L_3.pdf&src-supplier=Digi-Key; Supplier Part Number 1: AA0805JR-0775RL
SW1 = SW_PB: TL3305A Series SPST 12 V 4.5 x 4.5 mm 160 gf Top Actuated SMT Tactile Switch; Manufacturer: E-Switch; Supplier 1: Newark; Manufacturer Part Number: TL3305AF160QG; RoHS: Yes; Category: Tactile Switches; Stock 1: 12000; Pricing 1: 1=0.22100, 10=0.21500, 25=0.20400, 50=0.19400, 100=0.18500, 250=0.16800 (USD); ComponentLink1URL: http://www.farnell.com/datasheets/2554191.pdf?src-supplier=Farnell; ComponentLink1Description: http://www.farnell.com/datasheets/2554191.pdf?src-supplier=Farnell; ComponentLink2URL: http://www.farnell.com/datasheets/2554191.pdf?src-supplier=Newark; ComponentLink2Description: http://www.farnell.com/datasheets/2554191.pdf?src-supplier=Newark; ComponentLink3URL: http://spec_sheets.e-switch.com/specs/P010468.pdf?src-supplier=Digi-Key; ComponentLink3Description: http://spec_sheets.e-switch.com/specs/P010468.pdf?src-supplier=Digi-Key; Supplier Part Number 1: 84Y2774
U1 = STM32F103VBT6: ARM® Cortex®-M3 STM32 F1 Microcontroller IC 32-Bit 72MHz 128KB (128K x 8) FLASH; Manufacturer: STMicroelectronics; Interface: I2C,SPI,USB,CAN,IrDA,UART,USART,LIN; Max Supply Voltage: 3.6V; RAM Size: 20KB; Max Power Dissipation: 434mW; Number of I/Os: 80; Number of Timers/Counters: 4; Min Supply Voltage: 2V; Number of Programmable I/O: 100; Oscillator Type: Internal; Data Bus Width: 32b; Watchdog Timer: Yes; Peripherals: POR,PWM,WDT,DMA,Temp Sensor,I2C; Core Architecture: ARM; Number of PWM Channels: 1; Number of ADC Channels: 16; Number of SPI Channels: 2; Number of Bits: 32; Supplier 1: Newark; Manufacturer Part Number: STM32F103VBT6; RoHS: Yes; Category: Microcontrollers; Pricing 1: 1=10.53000, 10=9.52000, 25=9.08000, 50=8.48000, 100=7.89000, 250=7.53000 (USD); Case/Package: LQFP; Number of Pins: 100; Min Operating Temperature: -40°C; Max Operating Temperature: 85°C; Package Quantity: 90; Packaging: Tray; Frequency: 72MHz; Max Frequency: 72MHz; Memory Type: FLASH; Memory Size: 128KB; Series: STM32 F1; Density: 128KB; Number of I2C Channels: 2; Address Bus Width: 32b; Length: 14mm; Width: 14.2mm; Height: 1.45mm; Radiation Hardening: No; REACH SVHC: No SVHC; Lead Free: Lead Free; RoHS Compliant: Yes; ComponentLink1URL: https://datasheet.ciiva.com/5752/cd00161566-5752872.pdf?src-supplier=Farnell; ComponentLink1Description: https://datasheet.ciiva.com/5752/cd00161566-5752872.pdf?src-supplier=Farnell; ComponentLink2URL: https://datasheet.ciiva.com/4840/cd00161566-4840012.pdf?src-supplier=Mouser; ComponentLink2Description: https://datasheet.ciiva.com/4840/cd00161566-4840012.pdf?src-supplier=Mouser; Supplier Part Number 1: 59M2186
U2 = LMR51420XDDCR: SIMPLE SWITCHER® power converter 4.5-V to 36-V, 2-A, synchronous buck with 40-µA IQ 6-SOT-23-THIN -40 to 150; Manufacturer: Texas Instruments; Supplier 1: Mouser; Manufacturer Part Number: LMR51420XDDCR; RoHS: No; Stock 1: 2199; Pricing 1: 1=1.56000, 10=1.41000, 25=1.33000, 50=1.33000, 100=1.13000, 250=1.06000, 500=0.92800, 1000=0.77000, 3000=0.76900, 10000=0.76900 (USD); Supplier Part Number 1: 595-LMR51420XDDCR
U4 = LDO 3V3: Linear Voltage Regulator IC Positive Fixed 1 Output 3.3V 800mA SOT-223; Manufacturer: STMicroelectronics; Number of Terminals/Pins: 4; Package Body Material: Plastic; Number of Outputs: 1; Output Current: 950mA; Min Input Voltage: 5.3V; Dropout Voltage: 1.1V; Max Output Current: 1.3A; Max Input Voltage: 15V; Max Power Dissipation: 12W; Input Bias Current: 5mA; Quiescent Current: 10mA; Accuracy: 1%; Regulator Type: FIXED POSITIVE LDO REGULATOR; Time @ Peak Reflow Temperature-Max (s): 40s; Supplier 1: Newark; Manufacturer Part Number: LD1117S33CTR; RoHS: Yes; Category: Voltage Regulators - Linear; Pricing 1: 1=0.69300, 5=0.69300, 10=0.59500, 25=0.55500, 50=0.50000, 100=0.44400, 250=0.41300, 500=0.34900, 1000=0.27000 (USD); Mount: Surface Mount; Case/Package: SOT-223; Number of Pins: 4; Weight: 0.01lb; Contact Plating: Tin,Matte; Terminal Finish: Tin; Package Shape: Rectangular; Min Operating Temperature: -40°C; Max Operating Temperature: 125°C; Output Voltage: 3.3V; Packaging: Tape and Reel; Nominal Output Voltage: 3.3V; Package Quantity: 1; Max Supply Voltage: 15V; Min Supply Voltage: 3.3V; Number of Regulators: 1; Polarity: Positive; Min Output Voltage: 3.3V; Power Dissipation: 12W; Max Output Voltage: 3.3V; Termination: SMD/SMT; Output Voltage Accuracy: 1%; Output Type: Fixed; Series: -; Terminal Form: Gull Wing; Terminal Position: DUAL; Moisture Sensitivity Level: 1; JESD-30 Code: R-PDSO-G4; Surface Mount: Yes; Peak Reflow Temperature (Cel): 260°C; Technology: BIPOLAR; Length: 6.5mm; Width: 3.5mm; Height: 1.8mm; Radiation Hardening: No; REACH SVHC: No SVHC; Lead Free: Lead Free; RoHS Compliant: Yes; ComponentLink1URL: https://datasheet.ciiva.com/19480/1390223-19480586.pdf?src-supplier=Jameco; ComponentLink1Description: https://datasheet.ciiva.com/19480/1390223-19480586.pdf?src-supplier=Jameco; ComponentLink2URL: https://datasheet.ciiva.com/1511/1776449-1511572.pdf?src-supplier=Element14; ComponentLink2Description: https://datasheet.ciiva.com/1511/1776449-1511572.pdf?src-supplier=Element14; ComponentLink3URL: https://datasheet.ciiva.com/7992/1776449-7992620.pdf?src-supplier=Element14; ComponentLink3Description: https://datasheet.ciiva.com/7992/1776449-7992620.pdf?src-supplier=Element14; ComponentLink4URL: https://datasheet.ciiva.com/2041/cd00000544-2041933.pdf?src-supplier=Digi-Key; ComponentLink4Description: https://datasheet.ciiva.com/2041/cd00000544-2041933.pdf?src-supplier=Digi-Key; ComponentLink5URL: https://datasheet.ciiva.com/2041/cd00000544-2041932.pdf?src-supplier=Digi-Key; ComponentLink5Description: https://datasheet.ciiva.com/2041/cd00000544-2041932.pdf?src-supplier=Digi-Key; ComponentLink6URL: https://datasheet.ciiva.com/2041/cd00000544-2041934.pdf?src-supplier=Digi-Key; ComponentLink6Description: https://datasheet.ciiva.com/2041/cd00000544-2041934.pdf?src-supplier=Digi-Key; ComponentLink7URL: https://datasheet.ciiva.com/16392/cd00000544-16392069.pdf?src-supplier=Future+Electronics; ComponentLink7Description: https://datasheet.ciiva.com/16392/cd00000544-16392069.pdf?src-supplier=Future+Electronics; Supplier Part Number 1: 59M7494
U5 = MAX485CSA+: 1/1 Transceiver Half RS422, RS485 8-SOIC; Manufacturer: Maxim; Number of Receivers: 1; Operating Supply Voltage: 5V; Min Supply Voltage: 4.75V; Max Supply Voltage: 5.25V; Data Rate: 2.5Mbps; Interface: RS-422; Operating Supply Current: 500uA; Simplex/Duplex: Half Duplex; Supplier 1: Arrow Electronics; Manufacturer Part Number: MAX485CSA+; RoHS: Yes; Category: Buffers, Drivers and Transceivers; Stock 1: 250; Pricing 1: 1=3.45800, 10=2.88000, 25=2.64300, 50=2.24800, 100=2.08000, 500=2.05900 (USD); Mount: Surface Mount; Case/Package: SOIC; Number of Pins: 8; Weight: 0.01787oz; Contact Plating: Tin,Matte; Min Operating Temperature: 0°C; Max Operating Temperature: 70°C; Packaging: Rail/Tube; Package Quantity: 100; Number of Transmitters: 1; Logic Function: Transceiver; Number of Drivers: 1; Number of Transceivers: 1; Series: -; Nominal Supply Current: 500uA; Voltage: 5V; Length: 5mm; Width: 4mm; Height: 1.5mm; Radiation Hardening: No; REACH SVHC: No SVHC; Lead Free: Lead Free; RoHS Compliant: Yes; ComponentLink1URL: https://datasheet.ciiva.com/29306/170071-da-01-en-ic-max485csa-so8-29306144.pdf?src-supplier=Conrad; ComponentLink1Description: https://datasheet.ciiva.com/29306/170071-da-01-en-ic-max485csa-so8-29306144.pdf?src-supplier=Conrad; ComponentLink2URL: https://datasheet.ciiva.com/14152/jwmax481-491-data-e-14152715.pdf?src-supplier=Distrelec; ComponentLink2Description: https://datasheet.ciiva.com/14152/jwmax481-491-data-e-14152715.pdf?src-supplier=Distrelec; ComponentLink3URL: https://datasheet.ciiva.com/3028/max1487-max491-3028651.pdf?src-supplier=Avnet; ComponentLink3Description: https://datasheet.ciiva.com/3028/max1487-max491-3028651.pdf?src-supplier=Avnet; ComponentLink4URL: https://datasheet.ciiva.com/1712/max1487-max491-1712621.pdf?src-supplier=Digi-Key; ComponentLink4Description: https://datasheet.ciiva.com/1712/max1487-max491-1712621.pdf?src-supplier=Digi-Key; Supplier Part Number 1: MAX485CSA+
Y1 = Xtal_8MHZ: Crystal 8MHz ±30ppm (Tol) ±50ppm (Stability) 20pF FUND 80Ohm 2-Pin HC-49/USX Thru-Hole Bulk; Manufacturer: ECS International; ESR (Equivalent Series Resistance): 80R; Supplier 1: Avnet; Manufacturer Part Number: ECS-80-20-4X; RoHS: Yes; Category: Oscillators; Stock 1: 5000; Pricing 1: 200=0.33350, 210=0.32430, 410=0.31510, 1000=0.30590, 2000=0.29670 (USD); Mount: Through Hole; Number of Pins: 49; Weight: 0.019667oz; Min Operating Temperature: -10°C; Max Operating Temperature: 70°C; Package Quantity: 200; Series: HCS-49USX; Frequency: 8MHz; Packaging: Bulk; Termination: Radial; Load Capacitance: 20pF; Tolerance: 30ppm; Frequency Tolerance: 30ppm; Frequency Stability: 50ppm; Length: 11.35mm; Width: 4.65mm; Height: 3.5mm; RoHS Compliant: No; Lead Free: Lead Free; ComponentLink1URL: https://datasheet.ciiva.com/853/hc-49usx-853353.pdf?src-supplier=Digi-Key; ComponentLink1Description: https://datasheet.ciiva.com/853/hc-49usx-853353.pdf?src-supplier=Digi-Key; Supplier Part Number 1: ECS-80-20-4X
Y2 = XTAl_32.768_KHZ: Crystal 0.032768MHz ±20ppm (Tol) 6pF Flexural 70000Ohm 2-Pin CSMD T/R; Manufacturer: Abracon; ESR (Equivalent Series Resistance): 70kR; Supplier 1: Newark; Manufacturer Part Number: ABS07-32.768KHZ-6-T; RoHS: Yes; Category: Crystals; Stock 1: 12000; Pricing 1: 1=0.84600, 3000=0.84600 (USD); Mount: Surface Mount; Case/Package: CSMD; Number of Pins: 2; Min Operating Temperature: -40°C; Max Operating Temperature: 85°C; Frequency: 32.768kHz; Load Capacitance: 6pF; Packaging: Tape and Reel; Frequency Tolerance: 20ppm; Package Quantity: 3000; Tolerance: 20ppm; Termination: SMD/SMT; Series Resistance: 70kR; Series: ABS07; Operating Frequency: 32.768 kHz; Length: 3.2mm; Width: 0.061inch; Height: 0.035inch; Depth: 1.5mm; Radiation Hardening: No; RoHS Compliant: Yes; Lead Free: Lead Free; REACH SVHC: No SVHC; ComponentLink1URL: https://datasheet.ciiva.com/23810/1700986-23810482.pdf?src-supplier=Newark; ComponentLink1Description: https://datasheet.ciiva.com/23810/1700986-23810482.pdf?src-supplier=Newark; ComponentLink2URL: https://datasheet.ciiva.com/15116/getdatasheetpartid-719871-15116767.pdf?src-supplier=Verical; ComponentLink2Description: https://datasheet.ciiva.com/15116/getdatasheetpartid-719871-15116767.pdf?src-supplier=Verical; ComponentLink3URL: https://datasheet.ciiva.com/16216/abs07-16216664.pdf?src-supplier=Future+Electronics; ComponentLink3Description: https://datasheet.ciiva.com/16216/abs07-16216664.pdf?src-supplier=Future+Electronics; ComponentLink4URL: https://datasheet.ciiva.com/6733/abs07-6733371.pdf?src-supplier=Digi-Key; ComponentLink4Description: https://datasheet.ciiva.com/6733/abs07-6733371.pdf?src-supplier=Digi-Key; ComponentLink5URL: https://datasheet.ciiva.com/6733/abs07-6733372.pdf?src-supplier=Digi-Key; ComponentLink5Description: https://datasheet.ciiva.com/6733/abs07-6733372.pdf?src-supplier=Digi-Key; ComponentLink6URL: https://datasheet.ciiva.com/12387/abs07-11028-12387292.pdf?src-supplier=Mouser; ComponentLink6Description: https://datasheet.ciiva.com/12387/abs07-11028-12387292.pdf?src-supplier=Mouser; ComponentLink7URL: https://datasheet.ciiva.com/6733/abs07-6733373.pdf?src-supplier=Digi-Key; ComponentLink7Description: https://datasheet.ciiva.com/6733/abs07-6733373.pdf?src-supplier=Digi-Key; Supplier Part Number 1: 13AC8084